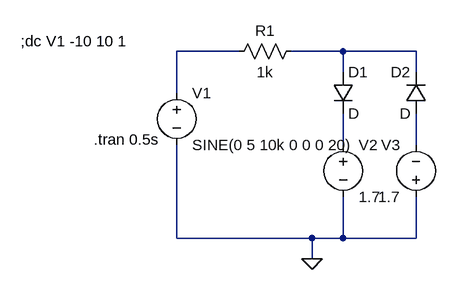
[diagram p0: schematic twolevelclipper.asc]
twolevelclipper.asc, the LTspice schematic file:
Version 4
SHEET 1 880 680
WIRE 224 16 128 16
WIRE 384 16 304 16
WIRE 496 16 384 16
WIRE 384 48 384 16
WIRE 496 48 496 16
WIRE 128 80 128 16
WIRE 384 160 384 112
WIRE 496 160 496 112
WIRE 128 304 128 160
WIRE 336 304 128 304
WIRE 384 304 384 240
WIRE 384 304 336 304
WIRE 496 304 496 240
WIRE 496 304 384 304
WIRE 336 336 336 304
FLAG 336 336 0
SYMBOL voltage 128 64 R0
WINDOW 123 24 124 Left 2
WINDOW 39 0 0 Left 0
SYMATTR InstName V1
SYMATTR Value SINE(0 5 10k 0 0 0 20)
SYMBOL res 320 0 R90
WINDOW 0 0 56 VBottom 2
WINDOW 3 32 56 VTop 2
SYMATTR InstName R1
SYMATTR Value 1k
SYMBOL diode 368 48 R0
SYMATTR InstName D1
SYMBOL voltage 384 144 R0
WINDOW 123 0 0 Left 0
WINDOW 39 0 0 Left 0
SYMATTR InstName V2
SYMATTR Value 1.7
SYMBOL diode 512 112 R180
WINDOW 0 24 64 Left 2
WINDOW 3 24 0 Left 2
SYMATTR InstName D2
SYMBOL voltage 496 256 R180
WINDOW 0 24 96 Left 2
WINDOW 3 24 16 Left 2
WINDOW 123 0 0 Left 0
WINDOW 39 0 0 Left 0
SYMATTR InstName V3
SYMATTR Value 1.7
TEXT -112 0 Left 2 !;dc V1 -10 10 1
TEXT 0 152 Left 2 !.tran 0.5s

The netlist it stands for:
* twolevelclipper.asc
V1 N001 0 SINE(0 5 10k 0 0 0 20)
R1 N002 N001 1k
D1 N002 N003 D
V2 N003 0 1.7
D2 N004 N002 D
V3 0 N004 1.7
.model D D
.lib standard.dio
;dc V1 -10 10 1
.tran 0.5s
.backanno
.end